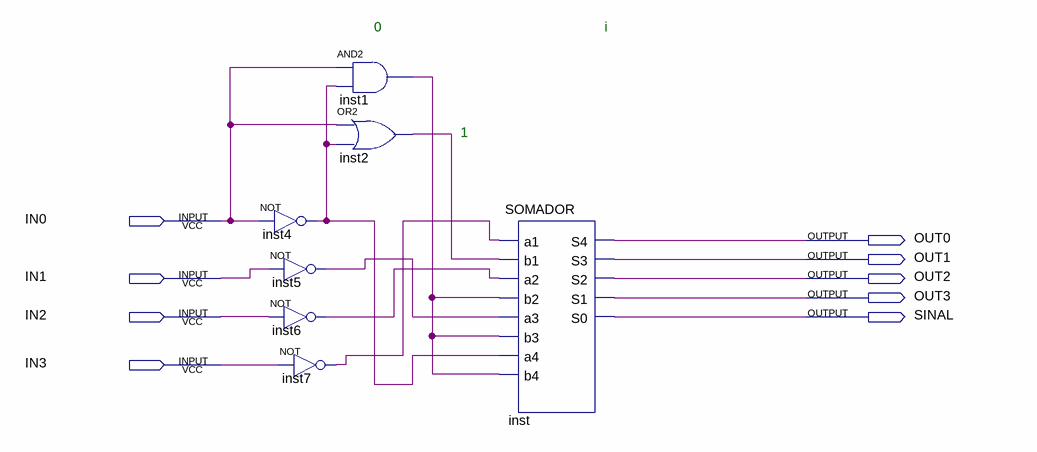
[diagram p0: schematic sheet]
// Quartus schematic COMPLEMENTO.bdf as structural Verilog: 7 symbols, 9 pins
module COMPLEMENTO (
  input  IN0,
  input  IN1,
  input  IN2,
  input  IN3,
  output OUT0,
  output OUT1,
  output OUT2,
  output OUT3,
  output SINAL
);

  wire inst1_out, inst2_out, inst4_out, inst5_out, inst6_out, inst7_out;

  not inst4 (inst4_out, IN0);
  not inst5 (inst5_out, IN1);
  not inst6 (inst6_out, IN2);
  not inst7 (inst7_out, IN3);
  and inst1 (inst1_out, IN0, inst4_out);
  or inst2 (inst2_out, IN0, inst4_out);
  SOMADOR inst (
    .a1(inst7_out), .b1(inst2_out), .a2(inst6_out), .b2(inst1_out), .a3(inst5_out), .b3(inst1_out),
    .a4(inst4_out), .b4(inst1_out), .S4(OUT0), .S3(OUT1), .S2(OUT2), .S1(OUT3), .S0(SINAL));

  // Notes on the sheet:
  //   0
  //   i
  //   1
endmodule
